# EAGLE schematic FanController_ATtiny4313 (EAGLE 7.3.0)
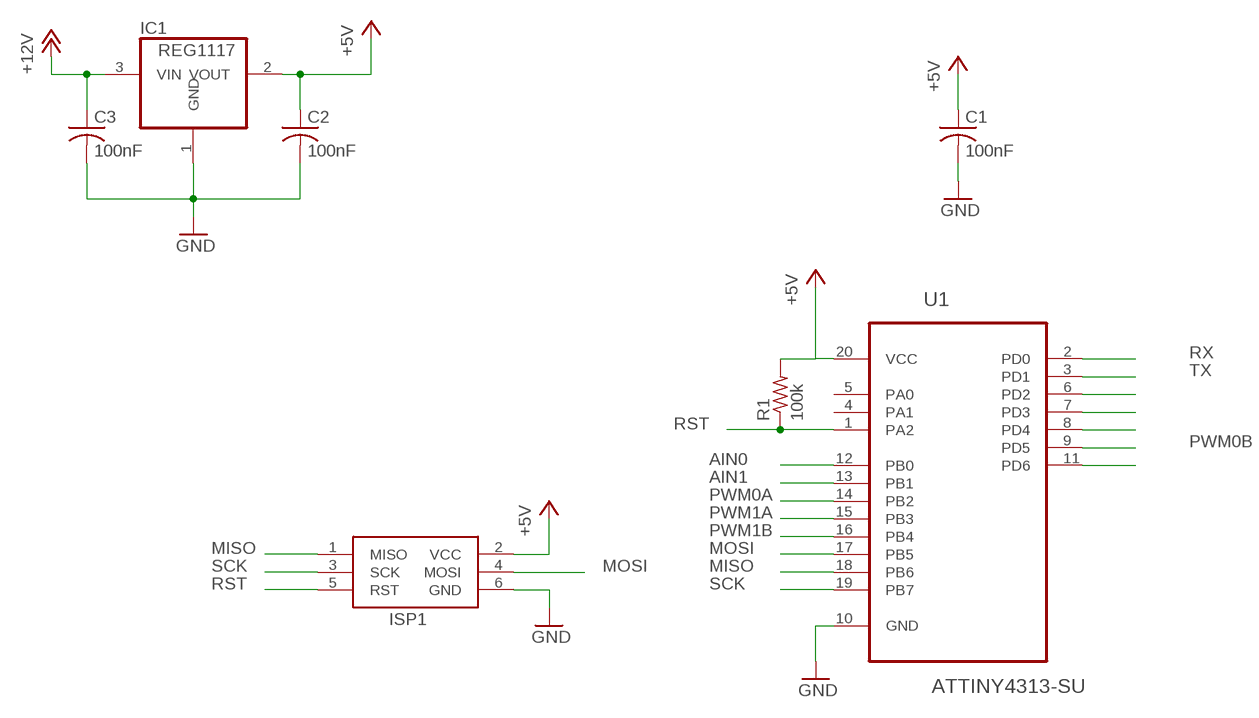
[diagram p0: schematic, sheet 1]

## Parts
C1  100nF  C-USC0805  [C0805]
C2  100nF  C-USC0805  [C0805]
C3  100nF  C-USC0805  [C0805]
IC1  REG1117  [SOT223]
ISP1  AVRISP-6  [AVRISP]
R1  100k  R-US_R0805  [R0805]
U1  ATTINY4313-SU  [SOIC127P1032X265-20N]

## Nets
+5V: C1.1 C2.1 IC1.2(VOUT) ISP1.2(VCC) R1.2 U1.20(VCC)
+12V: C3.1 IC1.3(VIN)
AIN0: U1.12(PB0)
AIN1: U1.13(PB1)
GND: C1.2 C2.2 C3.2 IC1.1(GND) ISP1.6(GND) U1.10(GND)
MISO: ISP1.1(MISO) U1.18(PB6)
MOSI: ISP1.4(MOSI) U1.17(PB5)
N$2: U1.8(PD4)
N$3: U1.7(PD3)
N$4: U1.6(PD2)
N$5: U1.11(PD6)
PWM0A: U1.14(PB2)
PWM0B: U1.9(PD5)
PWM1A: U1.15(PB3)
PWM1B: U1.16(PB4)
RST: ISP1.5(RST) R1.1 U1.1(PA2)
RX: U1.2(PD0)
SCK: ISP1.3(SCK) U1.19(PB7)
TX: U1.3(PD1)
Unconnected: U1.4(PA1) U1.5(PA0)

## Library data of the parts
C1-C3 = resistor:C-US: CAPACITOR, American symbol
IC1 = burr-brown:REG1117: 800mA and 1A Low Dropout (LDO) Positive Regulator 1.8V, 2.5V, 2.85V, 3.3V, 5V, and Adj; MPN: REG1117; OC_FARNELL: 1097566; OC_NEWARK: 14P6981
ISP1 = adafruit:AVRISP: AVR ISP HEADER Standard 6 pin header for AVR programming
R1 = resistor:R-US_: RESISTOR, American symbol
U1 = Atmel_By_element14_Batch_1-00:ATTINY4313-SU: 8-bit Microcontroller with In-System Programmable Flash; MPN: ATTINY4313-SU; OC_FARNELL: 1841621; OC_NEWARK: 12T1340; PACKAGE: SOIC-20; SUPPLIER: Atmel